# EAGLE design Raspberry Pi PCB (EAGLE 9.0.1)

## Sheet 1 of 2
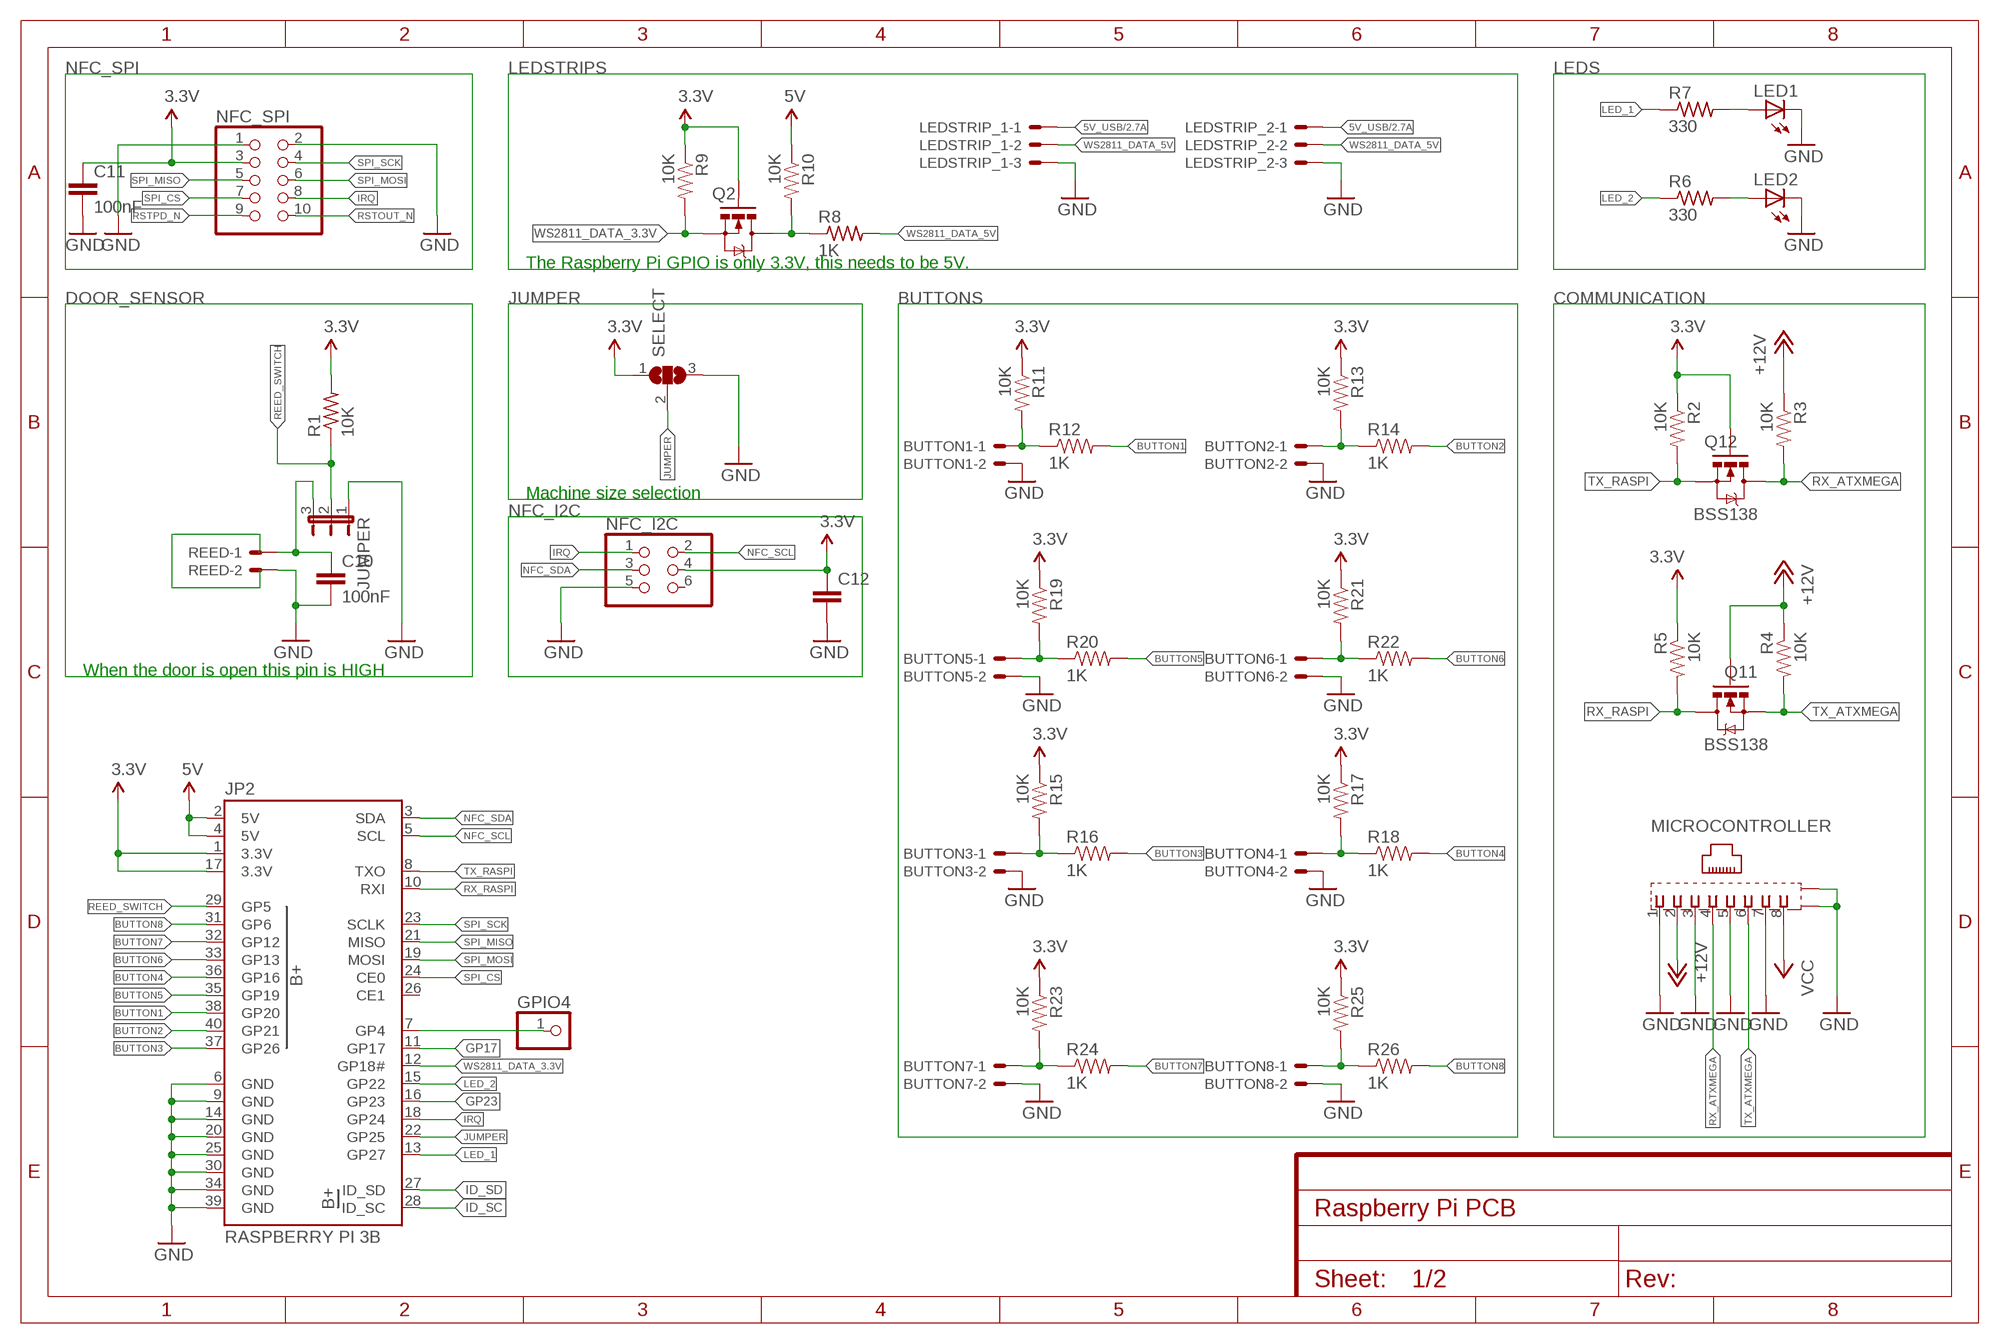
[diagram p0: schematic, sheet 1]
FRAME1 (FRAME-A4L): SPICEPREFIX: X

### Parts
BUTTON1  22-05-7028-02  [7395-02]
BUTTON2  22-05-7028-02  [7395-02]
BUTTON3  22-05-7028-02  [7395-02]
BUTTON4  22-05-7028-02  [7395-02]
BUTTON5  22-05-7028-02  [7395-02]
BUTTON6  22-05-7028-02  [7395-02]
BUTTON7  22-05-7028-02  [7395-02]
BUTTON8  22-05-7028-02  [7395-02]
C10  100nF  1.0UF-0805-25V-(+80/-20%)  [0805]
C11  100nF  1.0UF-0805-25V-(+80/-20%)  [0805]
C12  100nF  1.0UF-0805-25V-(+80/-20%)  [0805]
GPIO4  PINHD-1X1  [1X01]
JP2  RASPBERRY PI 3B  RASPBERRYPI-B+-GPIO  [2X20-SHROUDED]
JUMPER  JP2E  [JP2]
LED1  LEDCHIPLED_0805  [CHIPLED_0805]
LED2  LEDCHIPLED_0805  [CHIPLED_0805]
LEDSTRIP_1  22-05-7038-03  [7395-03]
LEDSTRIP_2  22-05-7038-03  [7395-03]
MICROCONTROLLER  0446200002  [0446200002]
NFC_I2C  PINHD-2X3  [2X03]
NFC_SPI  PINHD-2X5  [2X05]
Q2  BSS138  MOSFET-NCHANNELSMD  [SOT23-3]
Q11  BSS138  MOSFET-NCHANNELSMD  [SOT23-3]
Q12  BSS138  MOSFET-NCHANNELSMD  [SOT23-3]
R1  10K  R-US_R0805  [R0805]
R2  10K  RESISTOR0603-RES  [0603-RES]
R3  10K  RESISTOR0603-RES  [0603-RES]
R4  10K  RESISTOR0603-RES  [0603-RES]
R5  10K  RESISTOR0603-RES  [0603-RES]
R6  330  R-US_R0805  [R0805]
R7  330  R-US_R0805  [R0805]
R8  1K  R-US_R0805  [R0805]
R9  10K  RESISTOR0603-RES  [0603-RES]
R10  10K  RESISTOR0603-RES  [0603-RES]
R11  10K  RESISTOR0603-RES  [0603-RES]
R12  1K  RESISTOR0603-RES  [0603-RES]
R13  10K  RESISTOR0603-RES  [0603-RES]
R14  1K  RESISTOR0603-RES  [0603-RES]
R15  10K  RESISTOR0603-RES  [0603-RES]
R16  1K  RESISTOR0603-RES  [0603-RES]
R17  10K  RESISTOR0603-RES  [0603-RES]
R18  1K  RESISTOR0603-RES  [0603-RES]
R19  10K  RESISTOR0603-RES  [0603-RES]
R20  1K  RESISTOR0603-RES  [0603-RES]
R21  10K  RESISTOR0603-RES  [0603-RES]
R22  1K  RESISTOR0603-RES  [0603-RES]
R23  10K  RESISTOR0603-RES  [0603-RES]
R24  1K  RESISTOR0603-RES  [0603-RES]
R25  10K  RESISTOR0603-RES  [0603-RES]
R26  1K  RESISTOR0603-RES  [0603-RES]
REED  22-05-7028-02  [7395-02]
SELECT  SJ2W  [SJ_2]

### Nets
3.3V: C11.1 C12.1 JP2.1(3.3V) JP2.17(3.3V) NFC_I2C.4 NFC_SPI.3 Q2.1(G) Q12.1(G) R1.2 R2.1 R5.1 R9.1 R11.1 R13.1 R15.1 R17.1 R19.1 R21.1 R23.1 R25.1 SELECT.1
5V: JP2.2(5V) JP2.4(5V) R10.1 ; also sheet 2
5V_USB: LEDSTRIP_1.1 LEDSTRIP_2.1 ; also sheet 2
+12V: MICROCONTROLLER.2 Q11.1(G) R3.1 R4.1
BUTTON1: JP2.38(GP20) R12.2
BUTTON2: JP2.40(GP21) R14.2
BUTTON3: JP2.37(GP26) R16.2
BUTTON4: JP2.36(GP16) R18.2
BUTTON5: JP2.35(GP19) R20.2
BUTTON6: JP2.33(GP13) R22.2
BUTTON7: JP2.32(GP12) R24.2
BUTTON8: JP2.31(GP6) R26.2
GND: BUTTON1.2 BUTTON2.2 BUTTON3.2 BUTTON4.2 BUTTON5.2 BUTTON6.2 BUTTON7.2 BUTTON8.2 C10.2 C11.2 C12.2 JP2.6(GND) JP2.9(GND) JP2.14(GND) JP2.20(GND) JP2.25(GND) JP2.30(GND) JP2.34(GND) JP2.39(GND) JUMPER.1 LED1.C LED2.C LEDSTRIP_1.3 LEDSTRIP_2.3 MICROCONTROLLER.1 MICROCONTROLLER.3 MICROCONTROLLER.5 MICROCONTROLLER.7 MICROCONTROLLER.S@1(S1) MICROCONTROLLER.S@2(S2) NFC_I2C.5 NFC_SPI.1 NFC_SPI.2 REED.2 SELECT.3 ; also sheet 2
GP4: GPIO4.1 JP2.7(GP4)
GP17: JP2.11(GP17)
GP23: JP2.16(GP23)
ID_SC: JP2.28(ID_SC)
ID_SD: JP2.27(ID_SD)
IRQ: JP2.18(GP24) NFC_I2C.1 NFC_SPI.8
JUMPER: JP2.22(GP25) SELECT.2
LED_1: JP2.13(GP27) R7.1
LED_2: JP2.15(GP22) R6.1
N$1: C10.1 JUMPER.3 REED.1
N$2: BUTTON2.1 R13.2 R14.1
N$3: Q2.3(D) R8.1 R10.2
N$4: LED2.A R6.2
N$5: LED1.A R7.2
N$6: BUTTON1.1 R11.2 R12.1
N$7: BUTTON3.1 R15.2 R16.1
N$8: BUTTON4.1 R17.2 R18.1
N$9: BUTTON5.1 R19.2 R20.1
N$10: BUTTON6.1 R21.2 R22.1
N$11: BUTTON7.1 R23.2 R24.1
N$12: BUTTON8.1 R25.2 R26.1
NFC_SCL: JP2.5(SCL) NFC_I2C.2
NFC_SDA: JP2.3(SDA) NFC_I2C.3
REED_SWITCH: JP2.29(GP5) JUMPER.2 R1.1
RSTOUT_N: NFC_SPI.10
RSTPD_N: NFC_SPI.9
RX_ATXMEGA: MICROCONTROLLER.4 Q12.3(D) R3.2
RX_RASPI: JP2.10(RXI) Q11.3(D) R5.2
SPI_CS: JP2.24(CE0) NFC_SPI.7
SPI_MISO: JP2.21(MISO) NFC_SPI.5
SPI_MOSI: JP2.19(MOSI) NFC_SPI.6
SPI_SCK: JP2.23(SCLK) NFC_SPI.4
TX_ATXMEGA: MICROCONTROLLER.6 Q11.2(S) R4.2
TX_RASPI: JP2.8(TXO) Q12.2(S) R2.2
VCC: MICROCONTROLLER.8
WS2811_DATA_3.3V: JP2.12(GP18#) Q2.2(S) R9.2
WS2811_DATA_5V: LEDSTRIP_1.2 LEDSTRIP_2.2 R8.2
Unconnected: JP2.26(CE1) NFC_I2C.6

### Notes on the sheet
- The Raspberry Pi GPIO is only 3.3V, this needs to be 5V.
- Machine size selection
- When the door is open this pin is HIGH

## Sheet 2 of 2
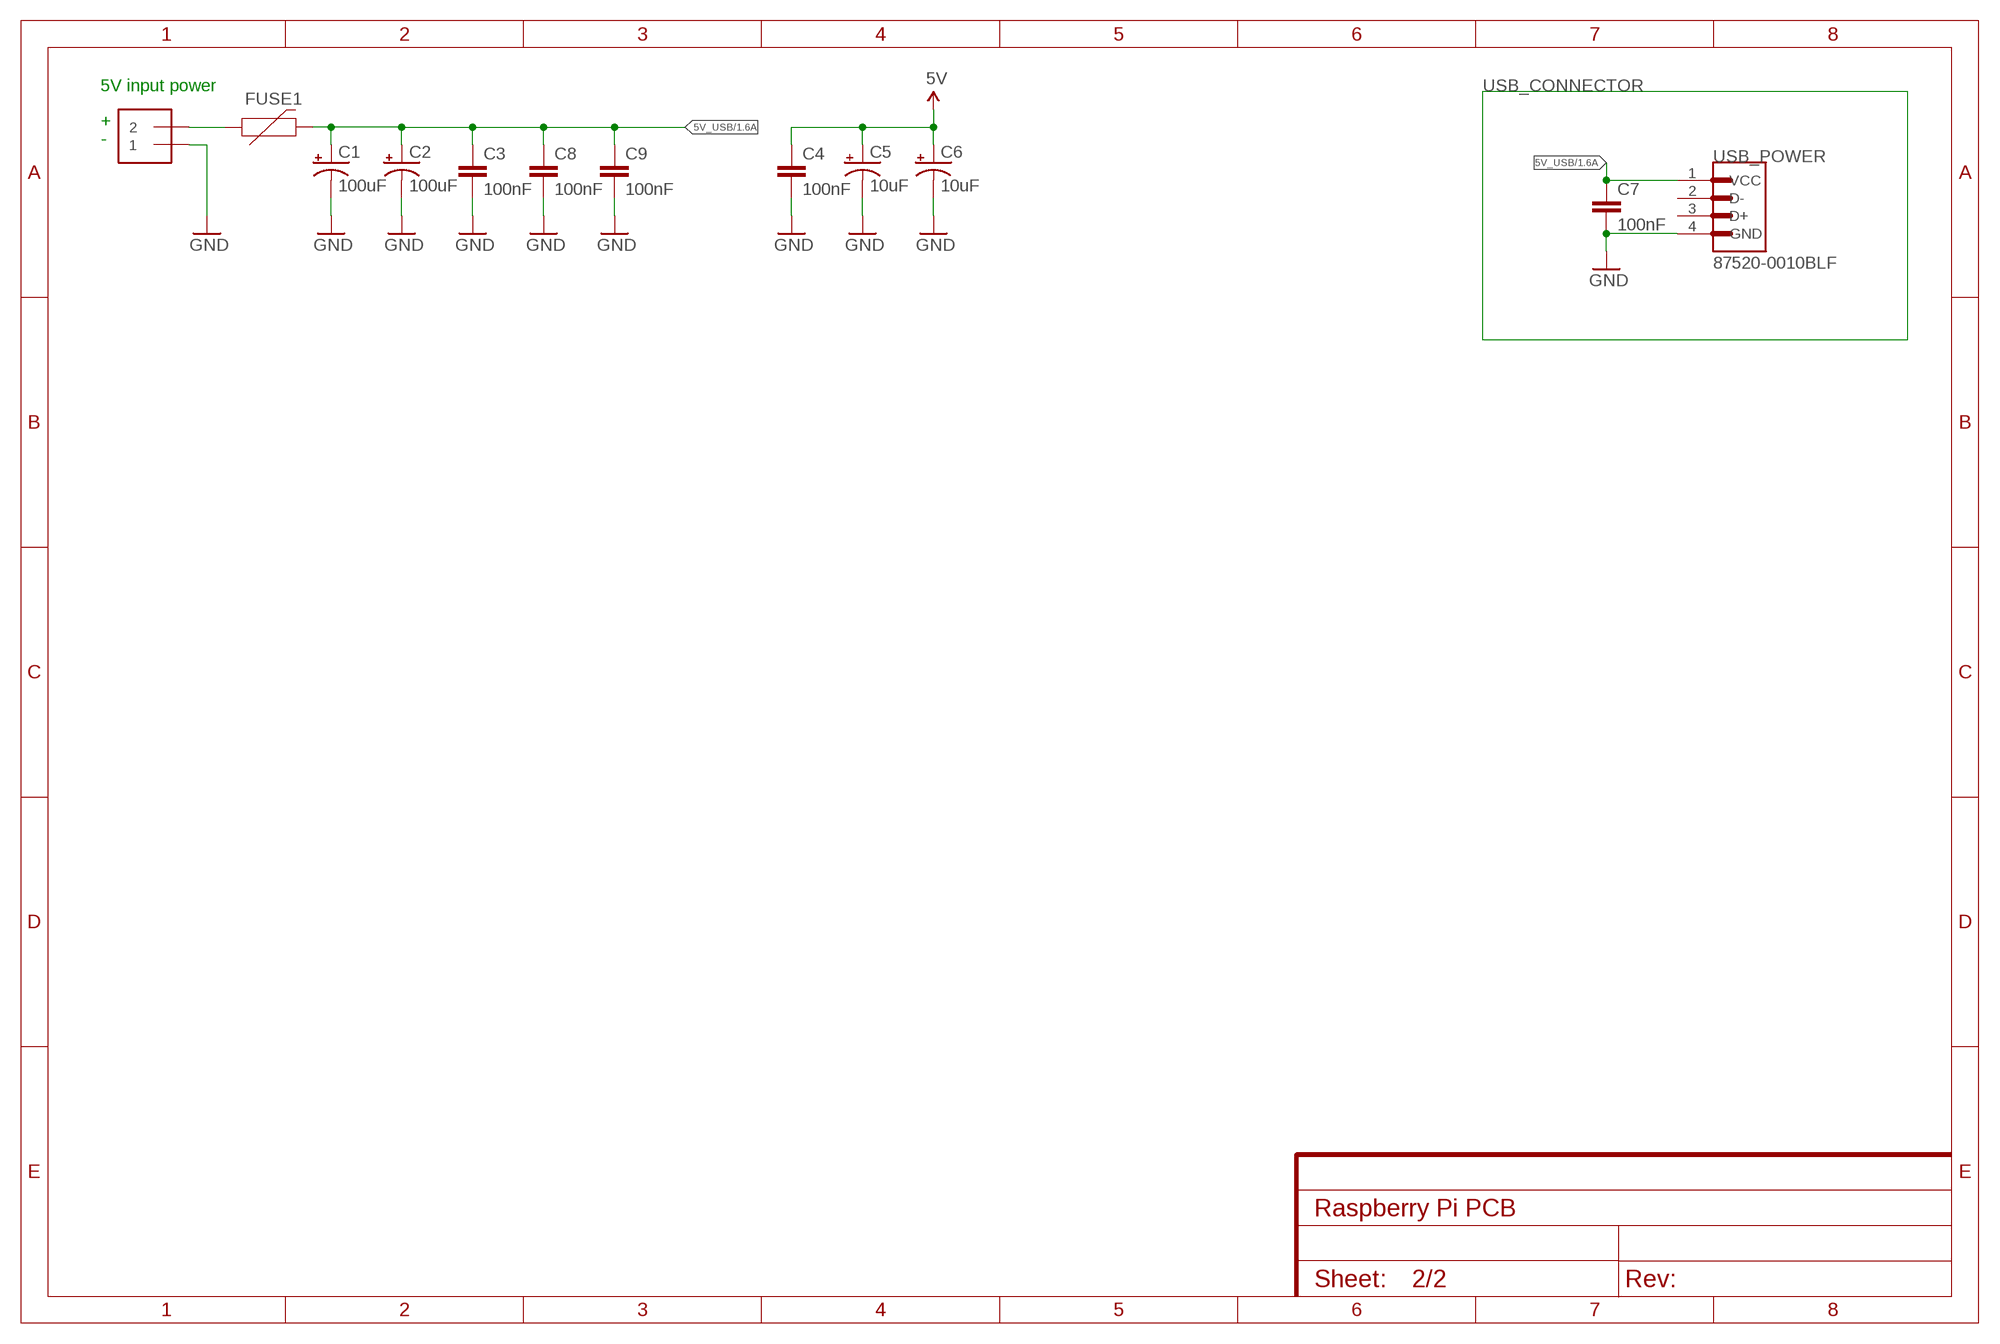
[diagram p1: schematic, sheet 2]

### Parts
C1  100uF  CPOL-US175TMP-0810  [175TMP-0810]
C2  100uF  CPOL-US175TMP-0810  [175TMP-0810]
C3  100nF  1.0UF-0805-25V-(+80/-20%)  [0805]
C4  100nF  1.0UF-0805-25V-(+80/-20%)  [0805]
C5  10uF  CPOL-US153CLV-0505  [153CLV-0505]
C6  10uF  CPOL-US153CLV-0505  [153CLV-0505]
C7  100nF  1.0UF-0805-25V-(+80/-20%)  [0805]
C8  100nF  1.0UF-0805-25V-(+80/-20%)  [0805]
C9  100nF  1.0UF-0805-25V-(+80/-20%)  [0805]
FUSE1  6V/0.5A  PPTC_HALF-AMP  [1206]
INPUT  1X2-3.5MM  [1X2-3.5MM]
USB_POWER  87520-0010BLF  [FCI_87520-0010BLF]

### Nets
5V: C4.1 C5.+ C6.+ ; also sheet 1
5V_USB: C1.+ C2.+ C3.1 C7.1 C8.1 C9.1 FUSE1.2 USB_POWER.1(VCC) ; also sheet 1
GND: C1.- C2.- C3.2 C4.2 C5.- C6.- C7.2 C8.2 C9.2 INPUT.1 USB_POWER.4(GND) ; also sheet 1
VIN1: FUSE1.1 INPUT.2
Unconnected: USB_POWER.2(D-) USB_POWER.3(D+)

### Notes on the sheet
- 5V input power
- +
- -

## Library data of the parts
BUTTON1-BUTTON8 REED = con-molex:22-?-02: CONNECTOR wire to board 2.54 mm (.1 inch) pitch header; MF: MOLEX; OC_FARNELL: 9731601; OC_NEWARK: unknown
C1 C2 C5 C6 = adafruit:CPOL-US: POLARIZED CAPACITOR, American symbol
C3 C4 C7-C12 = SparkFun-Capacitors:1.0UF: 1µF ceramic capacitors A capacitor is a passive two-terminal electrical component used to store electrical energy temporarily in an electric field.; PROD_ID: CAP-11625; VALUE: 1.0uF
FUSE1 = SparkFun-Fuses:PPTC: Resettable Fuse PPTC Resettable Fuse. Really a sort of resistor with a polymeric positive temperature coefficient whose resistance increases dramatically with an increase in temperature. When heated by the power passing through the resistance rises causing the current to be limited, protecting the circuit. This is achieved by the transition of the polymer from a crystalline to an amorphous state where the conductive carbon separates breaking the conductive pathways found in the cool crystalline structure. When a PPTC cools back down it resumes conducting letting the circuit turn back on. SparkFun Products: SparkFun RedBoard - Programmed with Arduino <https://www.sparkfun.com/products/12757> Pro Micro - 5V/16MHz <https://www.sparkfun.com/products/12640> Arduino Pro 328 - 5V/16MHz <https://www.sparkfun.com/products/10915> MP3 Trigger <https://www.sparkfun.com/products/13720>; PROD_ID: RES-08585
GPIO4 = pinhead:PINHD-1X1: PIN HEADER
INPUT = adafruit:1X2: 3.5mm Terminal block http://www.ladyada.net/library/pcb/eaglelibrary.html
JP2 = SparkFun-Boards:RASPBERRYPI-B+-GPIO: Raspberry Pi B+ GPIO Header 2x20 pin connector
JUMPER = jumper:JP2E: JUMPER
LED1 LED2 = adafruit:LED: LED OSRAM: - CHIPLED LG R971, LG N971, LY N971, LG Q971, LY Q971, LO R971, LY R971 LH N974, LH R974 LS Q976, LO Q976, LY Q976 LO Q996 - Hyper CHIPLED LW Q18S LB Q993, LB Q99A, LB R99A - SideLED LS A670, LO A670, LY A670, LG A670, LP A670 LB A673, LV A673, LT A673, LW A673 LH A674 LY A675 LS A676, LA A676, LO A676, LY A676, LW A676 LS A679, LY A679, LG A679 - Hyper Micro SIDELED® LS Y876, LA Y876, LO Y876, LY Y876 LT Y87S - SmartLED LW L88C, LW L88S LB L89C, LB L89S, LG L890 LS L89K, LO L89K, LY L89K LS L896, LA L896, LO L896, LY L896 - TOPLED LS T670, LO T670, LY T670, LG T670, LP T670 LSG T670, LSP T670, LSY T670, LOP T670, LYG T670 LG T671, LOG T671, LSG T671 LB T673, LV T673, LT T673, LW T673 LH T674 LS T676, LA T676, LO T676, LY T676, LB T676, LH T676, LSB T676, LW T676 LB T67C, LV T67C, LT T67C, LS T67K, LO T67K, LY T67K, LW E67C LS E67B, LA E67B, LO E67B, LY E67B, LB E67C, LV E67C, LT E67C LW T67C LS T679, LY T679, LG T679 LS T770, LO T770, LY T770, LG T770, LP T770 LB T773, LV T773, LT T773, LW T773 LH T774 LS E675, LA E675, LY E675, LS T675 LS T776, LA T776, LO T776, LY T776, LB T776 LHGB T686 LT T68C, LB T68C - Hyper Mini TOPLED® LB M676 - Mini TOPLED Santana® LG M470 LS M47K, LO M47K, LY M47K Source: http://www.osram.convergy.de/
LEDSTRIP_1 LEDSTRIP_2 = con-molex:22-?-03: CONNECTOR wire to board 2.54 mm (.1 inch) pitch header; MF: MOLEX; OC_FARNELL: unknown; OC_NEWARK: unknown
MICROCONTROLLER = con-molex:0446200002: RJ-45 INVERTED MODULAR JACK ASSEMBLY WITH RJ-11 KEEPOUT FEATURE Source: Data sheet <http://www.farnell.com/datasheets/73207.pdf> MOLEX 0446200002 BUCHSE, RJ45, GESCHIRMT Source: Farnell <http://de.farnell.com/molex/0446200002/buchse-rj45-geschirmt/dp/9251910?ost=9251910>; MF: MOLEX; MPN: 0446200002; OC_FARNELL: 9251910
NFC_I2C = pinhead:PINHD-2X3: PIN HEADER
NFC_SPI = pinhead:PINHD-2X5: PIN HEADER
Q2 Q11 Q12 = SparkFun:MOSFET-NCHANNEL
R1 R6-R8 = adafruit:R-US_: RESISTOR, American symbol
R2-R5 R9-R26 = SparkFun:RESISTOR: Resistor Basic schematic elements and footprints for 0603, 1206, and PTH resistors.
SELECT = jumper:SJ2W: SMD solder JUMPER
USB_POWER = 87520-0010BLF:87520-0010BLF: USB - A USB 2.0 Receptacle Connector 4 Position Through Hole, Right Angle; DESCRIPTION: 87520 Series Single Port 4 Contact Unshielded Board Lock USB-A Receptacle; DIGI-KEY_PART_NUMBER: 609-1045-ND; DIGI-KEY_PURCHASE_URL: https://www.digikey.nl/product-detail/en/amphenol-fci/87520-0010BLF/609-1045-ND/1001359?WT.z_cid=ref_snapeda&utm_source=snapeda&utm_medium=aggregator&utm_campaign=buynow; MF: Amphenol ICC; MP: 87520-0010BLF; PACKAGE: None

## Board
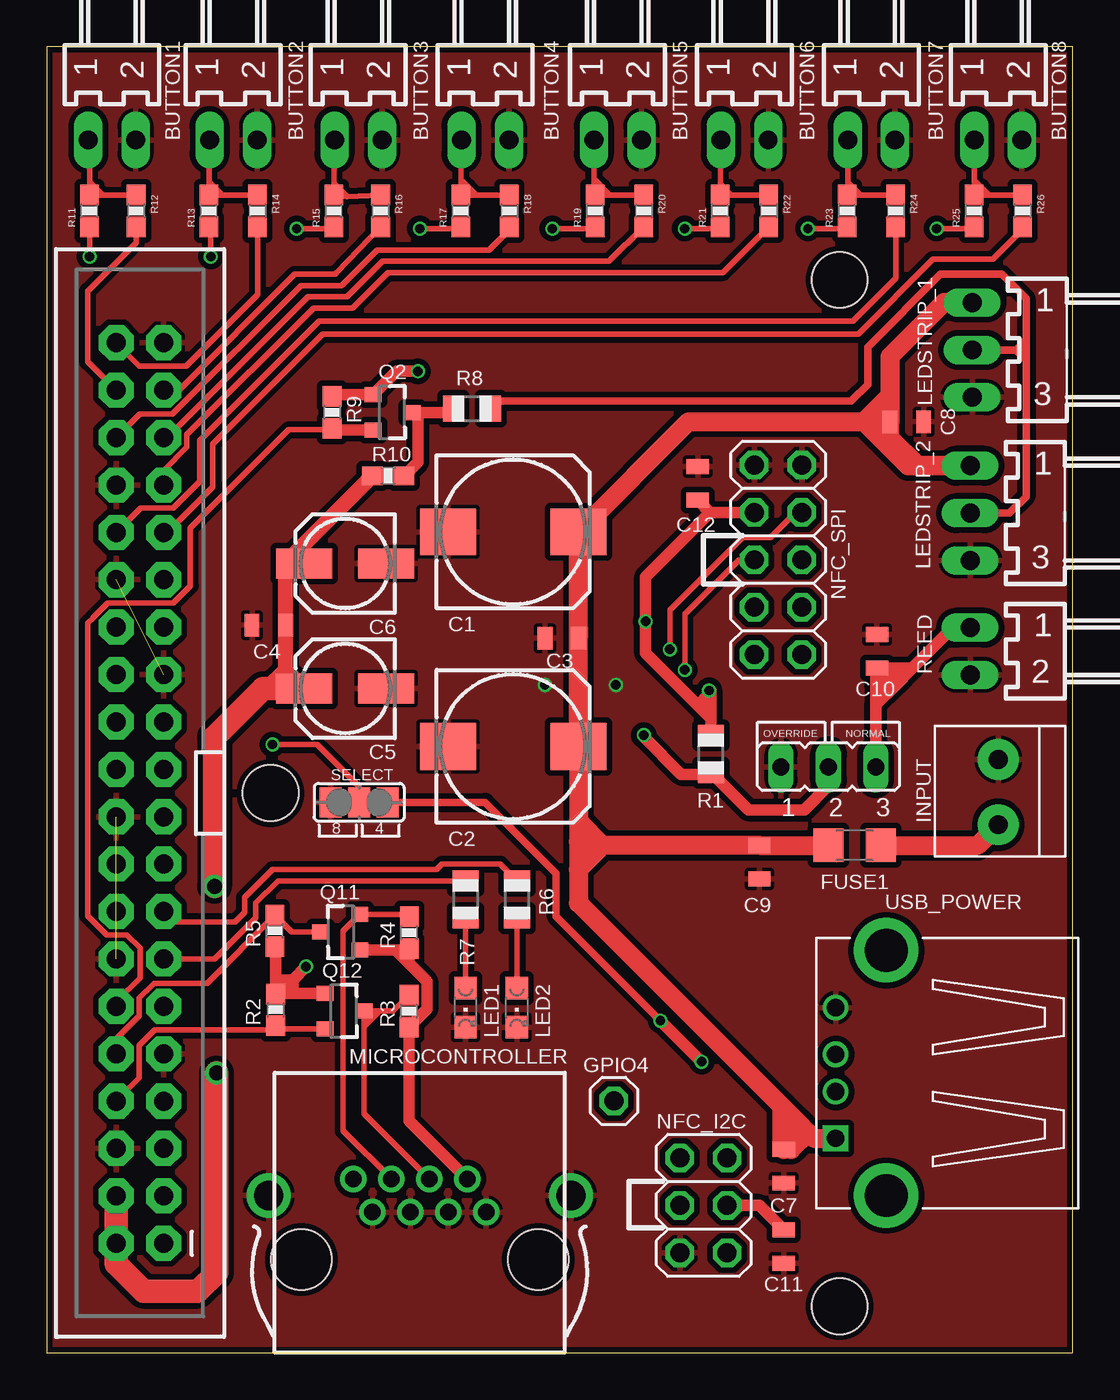
[diagram p2: board, top side]
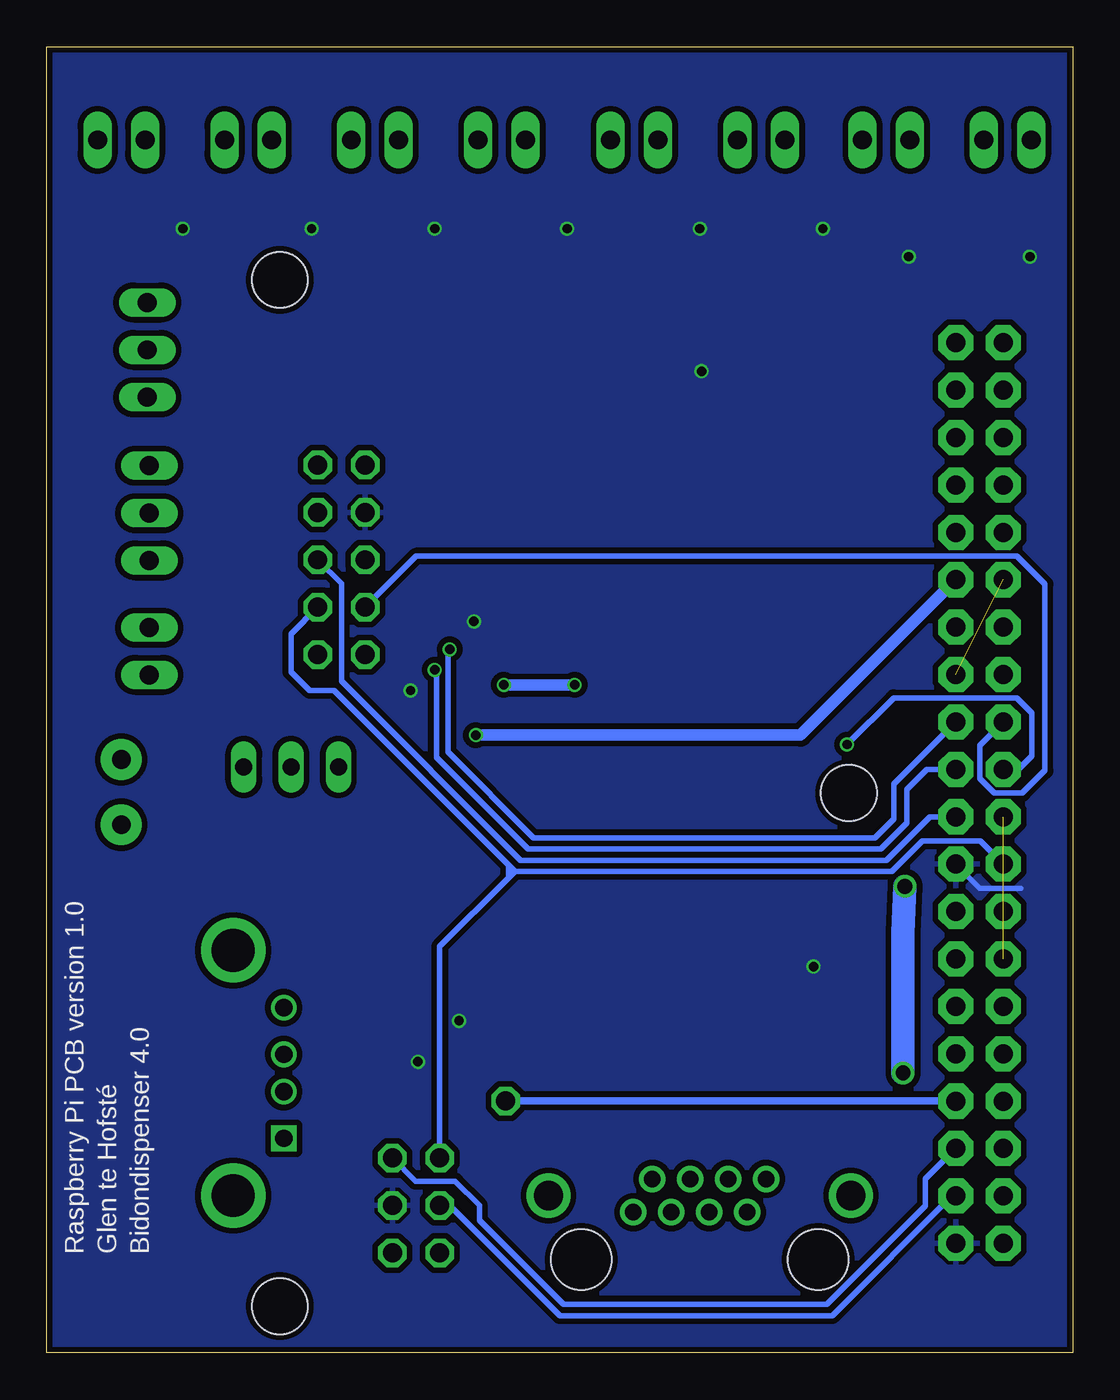
[diagram p3: board, bottom side, seen from below]

Size 55 x 70 mm. Coordinates in mm from the lower left corner, seen from the top.
Outline: 55,70 0,70 0,0 55,0 55,70
Copper layers (1*16): Top 0.018mm / dielectric 1.55mm / Bottom 0.018mm
Design rules "eC_2Layer_PClass6_BaseCopperO18_eCDefault": minimum track width 0.15mm, minimum drill 0.35mm, track to track 0.15mm, track to pad 0.15mm, pad to pad 0.15mm, via to via 0.15mm, smd to smd 0mil, copper to edge 0.25mm, drill to drill 0.35mm, minimum pad ring 0.175mm, minimum via ring 0.125mm, stop-mask expansion 0mil, vias tented up to drill 0.45mm, thermal gap 0.2mm
Holes 3 mm at 42.5,57.5 42.5,2.5 12,30

### Footprints (pad centres in the part's own frame; a part is rotated, then mirrored left to right if it is on the bottom)
7395-02 = drill 1.016 long: 1 1.27,0; 2 -1.27,0
175TMP-0810 = smd 3 x 2.5: + 3.5,0; - -3.5,0
0805 = smd 0.8 x 1.2: 1 -0.9,0; 2 0.9,0
153CLV-0505 = smd 3 x 1.6: + 2.2,0; - -2.2,0
1206 = smd 1.6 x 1.8: 1 -1.4,0; 2 1.4,0
1X01 = drill 1.016 octagon: 1 0,0
1X2-3.5MM = drill 1 pad 2.184: 1 1.8,0; 2 -1.7,0
2X20-SHROUDED = drill 1.016 pad 1.88 octagon: 1 -1.27,24.13; 2 1.27,24.13; 3 -1.27,21.59; 4 1.27,21.59; 5 -1.27,19.05; 6 1.27,19.05; 7 -1.27,16.51; 8 1.27,16.51; 9 -1.27,13.97; 10 1.27,13.97; 11 -1.27,11.43; 12 1.27,11.43; 13 -1.27,8.89; 14 1.27,8.89; 15 -1.27,6.35; 16 1.27,6.35; 17 -1.27,3.81; 18 1.27,3.81; 19 -1.27,1.27; 20 1.27,1.27; 21 -1.27,-1.27; 22 1.27,-1.27; 23 -1.27,-3.81; 24 1.27,-3.81; 25 -1.27,-6.35; 26 1.27,-6.35; 27 -1.27,-8.89; 28 1.27,-8.89; 29 -1.27,-11.43; 30 1.27,-11.43; 31 -1.27,-13.97; 32 1.27,-13.97; 33 -1.27,-16.51; 34 1.27,-16.51; 35 -1.27,-19.05; 36 1.27,-19.05; 37 -1.27,-21.59; 38 1.27,-21.59; 39 -1.27,-24.13; 40 1.27,-24.13
JP2 = drill 0.914 long: 1 -2.54,0; 2 0,0; 3 2.54,0
CHIPLED_0805 = smd 1.2 x 1.2: A 0,-1.05; C 0,1.05
7395-03 = drill 1.016 long: 1 2.54,0; 2 0,0; 3 -2.54,0
0446200002 = drill 0.889 pad 1.422: 1 3.556,2.54; 2 2.54,4.318; 3 1.524,2.54; 4 0.508,4.318; 5 -0.508,2.54; 6 -1.524,4.318; 7 -2.54,2.54; 8 -3.556,4.318 | drill 1.575 pad 2.286: S@1 -8.103,3.429; S@2 8.103,3.429 | hole 3.251: 6.35,0; -6.35,0
2X03 = drill 1.016 octagon: 1 -2.54,-1.27; 2 -2.54,1.27; 3 0,-1.27; 4 0,1.27; 5 2.54,-1.27; 6 2.54,1.27
2X05 = drill 1.016 octagon: 1 -5.08,-1.27; 2 -5.08,1.27; 3 -2.54,-1.27; 4 -2.54,1.27; 5 0,-1.27; 6 0,1.27; 7 2.54,-1.27; 8 2.54,1.27; 9 5.08,-1.27; 10 5.08,1.27
SOT23-3 = smd 0.8 x 0.9: 1 -0.95,-1; 2 0.95,-1; 3 0,1.1
R0805 = smd 1.1 x 1.4: 1 -1,0; 2 1,0
0603-RES = smd 1.1 x 1: 1 -0.85,0; 2 0.85,0
SJ_2 = smd 1.168 x 1.6: 1 -1.524,0; 2 0,0; 3 1.524,0
FCI_87520-0010BLF = drill 0.92 square: 1 -3.5,2.71 | drill 0.92: 2 -1,2.71; 3 1,2.71; 4 3.5,2.71 | drill 2.3: P1 -6.57,0; P2 6.57,0

### Placement (x,y rotation side)
BUTTON1  3.5,65 180 top
BUTTON2  10,65 180 top
BUTTON3  16.7,65 180 top
BUTTON4  23.5,65 180 top
BUTTON5  30.6,65 180 top
BUTTON6  37.4,65 180 top
BUTTON7  44.2,65 180 top
BUTTON8  51,65 180 top
C1  25,44 0 top
C2  25,32.5 0 top
C3  27.6,38.3 180 top
C4  11.9,39 180 top
C5  16,35.6 180 top
C6  16,42.3 180 top
C7  39.5,10 270 top
C8  46.1,49.9 0 top
C9  38.2,26.3 270 top
C10  44.5,37.6 90 top
C11  39.5,5.7 270 top
C12  34.9,46.6 90 top
FUSE1  43.3,27.2 180 top
GPIO4  30.4,13.5 0 top
INPUT  51,30 90 top
JP2  5,30 180 top
JUMPER  41.9,31.4 0 top
LED1  22.45,18.5 180 top
LED2  25.2,18.5 180 top
LEDSTRIP_1  49.6,53.75 90 top
LEDSTRIP_2  49.5,45 90 top
MICROCONTROLLER  20,5 0 top
NFC_I2C  35.2,7.9 270 top
NFC_SPI  39.2,42.5 270 top
Q2  18.5,50.4 270 top
Q11  15.78,22.55 90 top
Q12  15.92,18.32 270 top
R1  35.6,32.1 90 top
R2  12.27,18.39 270 top
R3  19.43,18.31 90 top
R4  19.43,22.51 90 top
R5  12.23,22.61 90 top
R6  25.2,24.3 270 top
R7  22.45,24.3 270 top
R8  22.8,50.6 0 top
R9  15.3,50.4 270 top
R10  18.3,47 0 top
R11  2.3,61.2 90 top
R12  4.8,61.2 270 top
R13  8.7,61.2 90 top
R14  11.3,61.2 270 top
R15  15.4,61.2 90 top
R16  17.9,61.2 270 top
R17  22.2,61.2 90 top
R18  24.8,61.2 270 top
R19  29.4,61.2 90 top
R20  32,61.2 270 top
R21  36.1,61.2 90 top
R22  38.7,61.2 270 top
R23  42.9,61.2 90 top
R24  45.5,61.2 270 top
R25  49.7,61.2 90 top
R26  52.3,61.2 270 top
REED  49.5,37.6 90 top
SELECT  16.75,29.5 180 top
USB_POWER  45,15 90 top

### Tracks (layer width: path | path; a pad name or v marks a point on that pad's centre or on a via)
3.3V  (via drill 0.5)
  Top 0.305: v2.3,58.75 R11.1 | v8.8,58.75 8.8,60.25 R13.1 | v13.4,60.25 15.3,60.25 R15.1 | v20,60.25 22.1,60.25 R17.1 | v27.1,60.25 29.3,60.25 R19.1 | v34.2,60.25 36,60.25 R21.1 | v40.8,60.25 42.8,60.25 R23.1 | v47.7,60.25 49.6,60.25 R25.1
  Top 0.406: SELECT.1 23.5,29.5 27.3,25.7 27.3,23.4 v32.9,17.8
  Top 0.61: R5.1 12.27,21.72 12.27,20.2 | 12.27,20.2 R2.1 | R2.1 12.31,19.27 13.2,19.27 | 13.2,19.27 Q12.1 | 13.2,19.27 12.47,20 | v13.9,20.7 13.2,20 | 13.2,20 12.44,19.24 R2.1 | 13.2,20 13.2,19.27 | 13.2,20 12.47,20 | 12.47,20 12.27,20.2 | R9.1 15.4,51.35 Q2.1 18.75,52.6 v19.9,52.6 | 35.6,34 35.6,35.5 v35.5,35.5 35.5,35.3 34.9,34.7 | 35.6,34 R1.2 | C12.1 35.56,45.04 | 35.56,45.04 NFC_SPI.3 | 35.6,34 34.9,34.7 | 34.9,34.7 32.1,37.5 v32.1,39.2 32.1,41.58 35.56,45.04 | C11.1 38.2,7.9 NFC_I2C.4 | v35.1,15.6 v32.9,17.8
  Bottom 0.305: JP2.17 4.98,24.9 2.8,24.9
  pour Bottom (isolate 0.305, rank 2): 0,70 55,70 55,0 0,0
5V  (via drill 0.8)
  Top 0.813: C5.+ 12.8,36.6 | 12.8,36.6 C4.1 12.8,42 | 12.8,42 13.1,42.3 C6.+ 13.8,43.35 | 12.8,36.6 11.8,35.6 11.6,35.6 | 13.8,43.35 R10.1 | 13.8,43.35 12.8,42.35 12.8,42
  Top 1.27: JP2.4 JP2.2 3.73,4.77 5.2,3.3 8.1,3.3 9.1,4.3 v9.1,15 | C5.+ 11.6,35.6 9,33 v9,25
  Bottom 1.27: v9,25 9.1,22.5 v9.1,15
5V_USB
  Top 1.016: C3.1 C2.+ 28.5,28.5 | C3.1 C1.+ | 28.5,44.6 C1.+ | 28.5,38.9 C3.1 | 28.5,28.5 28.5,27.4 | 28.5,27.4 28.5,25.9 | 28.5,25.9 28.5,24.1 39.4,13.2 | USB_POWER.1 41.1,11.5 40.8,11.8 | 39.4,13.2 40.15,12.45 | 40.15,12.45 40.8,11.8 | 40.8,11.8 39.9,10.9 C7.1 39.4,11 39.4,11.4 | 39.4,11.4 39.4,13.2 | 40.15,12.45 40.15,12.15 39.4,11.4 | 29.8,27.2 28.7,27.2 28.5,27.4 | 29.8,27.2 28.5,28.5 | 29.8,27.2 28.5,25.9 | 29.8,27.2 C9.1 FUSE1.2 | C1.+ 34.4,49.9 43.8,49.9 | 43.8,49.9 C8.1 | C8.1 45.2,49 46.66,47.54 LEDSTRIP_2.1 46.16,47.54 43.8,49.9 | 50.41,56.29 LEDSTRIP_1.1 48.09,56.29 45.2,53.4 45.2,51.3 | 45.2,51.3 C8.1 | 45.2,51.3 43.8,49.9
+12V
  Top 0.305: Q11.1 16.9,21.61 | R3.1 19.43,16.7
  Top 0.61: 19.43,20.88 19.43,21.55 19.37,21.61 | R4.1 19.37,21.61 | 19.37,21.61 18.7,21.61 | 18.7,21.61 16.9,21.61 | 18.7,21.61 19.43,20.88 | MICROCONTROLLER.2 19.43,12.43 19.43,16.7 R3.1 20.38,18.43 20.38,19.9 19.43,20.86 19.43,20.88
BUTTON1
  Top 0.305: JP2.38 2.2,53.12 2.2,56.9 4.8,59.5 R12.2
BUTTON2
  Top 0.305: JP2.40 4.97,52.89 7.49,52.89 11.3,56.7 R14.2
BUTTON3
  Top 0.305: R16.2 15.55,57.9 15.45,57.8 13.3,57.8 7.09,51.59 JP2.37
BUTTON4
  Top 0.305: R18.2 24.8,60.2 23.7,59.1 17.7,59.1 15.8,57.2 13.64,57.2 6.74,50.3 4.98,50.3 JP2.36
BUTTON5
  Top 0.305: JP2.35 6.45,49.05 14,56.6 16.1,56.6 18,58.5 30.15,58.5 R20.2
BUTTON6
  Top 0.305: JP2.33 6.27,47.29 7.51,48.53 7.51,49.21 14.3,56 16.4,56 18.3,57.9 36.25,57.9 R22.2
BUTTON7
  Top 0.305: JP2.32 5.03,45.27 6.79,45.27 8.2,46.68 8.2,48.9 14.6,55.3 43.2,55.3 45.5,57.6 R24.2
BUTTON8
  Top 0.305: JP2.31 6.47,43.97 8.9,46.4 8.9,48.7 14.8,54.6 43.5,54.6 47.5,58.6 50.7,58.6 52.3,60.2 R26.2
GND  (via drill 0.5)  (2 unrouted)
  Bottom 0.61: v30.5,35.8 v26.7,35.8
  pour Top (isolate 0.305, rank 2): -0.1,70 55,70 55,0 -0.1,0
GP4
  Bottom 0.406: JP2.7 GPIO4.1
IRQ
  Bottom 0.305: JP2.18 4.97,27.43 8.07,27.43 9.7,25.8 29.9,25.8 | NFC_SPI.8 41.9,38.53 41.9,36.5 40.9,35.5 39.6,35.5 30.25,26.15 | 29.9,25.8 30.25,26.15 | 29.9,25.8 30.25,25.45 | NFC_I2C.1 33.93,21.77 30.3,25.4 30.25,25.45 | 30.25,26.15 30.25,25.45
JUMPER  (via drill 0.5)
  Top 0.305: v12.1,32.6 14.5,32.6 16.75,30.35 SELECT.2
  Bottom 0.305: v12.1,32.6 9.6,35.1 3,35.1 2.2,34.3 2.2,32 2.93,31.27 JP2.22
LED_1
  Top 0.305: R7.1 12.4,25.3 11.2,24.1 11.2,23.3 9.01,21.11 JP2.13
LED_2
  Top 0.305: JP2.15 6.82,23.1 10.1,23.1 10.6,23.6 10.6,24.4 12.1,25.9 20.9,25.9 21.2,26.2 24.3,26.2 R6.1
N$1
  Top 0.61: JUMPER.3 44.44,34.74 | REED.1 48.57,38.87 46.4,36.7 | 44.44,34.74 45.5,35.8 | 45.5,35.8 46.4,36.7 | 44.44,35.8 44.44,36.64 C10.1 45.5,36.7 | 44.44,35.8 44.44,34.74 | 44.6,35.8 45.5,35.8 | 45.5,36.7 46.4,36.7 | 45.5,36.7 44.6,35.8 | 44.6,35.8 44.44,35.8 | 45.5,36.7 45.5,35.8
N$2
  Top 0.305: R14.1 9.4,62.05 | 9.4,62.05 R13.2 8.7,62.75 | BUTTON2.1 8.7,64.97 8.7,62.9 8.7,62.75 | 9.4,62.05 8.7,62.75
N$3
  Top 0.61: Q2.3 19.9,50.4 | 19.9,50.4 21.6,50.4 R8.1 | R10.2 19.9,47.75 19.9,50.4
N$4
  Top 0.305: R6.2 LED2.A
N$5
  Top 0.305: R7.2 LED1.A
N$6
  Top 0.305: 2.3,62.75 R11.2 3,62.05 | BUTTON1.1 2.3,64.93 2.3,62.9 2.3,62.75 | 3,62.05 R12.1 | 3,62.05 2.3,62.75
N$7
  Top 0.305: R16.1 16.1,61.95 | 16.1,61.95 R15.2 15.4,62.65 | 15.4,62.65 15.4,64.97 BUTTON3.1 | 16.1,61.95 15.4,62.65
N$8
  Top 0.305: R18.1 23,62.05 | 23,62.05 R17.2 22.2,62.85 | BUTTON4.1 22.2,64.97 22.2,62.9 22.2,62.85 | 23,62.05 22.2,62.85
N$9
  Top 0.305: R20.1 30.2,62.05 | 30.2,62.05 R19.2 29.33,62.12 29.33,62.9 | 29.33,62.9 BUTTON5.1 | 30.2,62.05 29.35,62.9 29.33,62.9
N$10
  Top 0.305: R22.1 36.7,62.05 | 36.7,62.05 R21.2 36.1,62.65 | BUTTON6.1 36.1,64.97 36.1,62.9 36.1,62.65 | 36.7,62.05 36.1,62.65
N$11
  Top 0.305: R24.1 43.6,62.05 | 43.6,62.05 R23.2 42.93,62.08 42.93,62.72 | BUTTON7.1 42.93,62.8 42.93,62.72 | 43.6,62.05 42.93,62.72
N$12
  Top 0.305: R26.1 50.5,62.05 | 50.5,62.05 R25.2 49.73,62.08 49.73,62.82 | BUTTON8.1 49.73,62.9 49.73,62.82 | 50.5,62.05 49.73,62.82
NFC_SCL
  Bottom 0.305: JP2.5 7.9,9.32 7.9,7.88 13.18,2.6 27.3,2.6 31.8,7.1 31.8,7.9 33.1,9.2 35.23,9.2 NFC_I2C.2
NFC_SDA
  Bottom 0.305: JP2.3 6.49,8.41 12.9,2 27.5,2 33.4,7.9 NFC_I2C.3
REED_SWITCH  (via drill 0.5)
  Top 0.61: JUMPER.2 41.9,30.4 40.6,29.1 37.6,29.1 R1.1 35.5,31 34,31 32,33 v32,33.1
  Bottom 0.61: JP2.29 14.6,33.1 v32,33.1
RX_ATXMEGA
  Top 0.305: 17.02,17.8 Q12.3 17.54,18.32 | 17.02,17.8 17.02,17.5 | 17.02,17.5 17.02,12.81 MICROCONTROLLER.4 | R3.2 18.58,18.32 17.84,18.32 | 17.02,17.8 17.54,18.32 | 17.54,18.32 17.84,18.32 | 17.02,17.5 17.84,18.32
RX_RASPI
  Top 0.305: Q11.3 13.14,22.55 R5.2 12.23,23.43 8.61,19.81 5.75,19.81 4.97,19.03 4.97,18.05 3.73,16.81 JP2.10
SPI_CS
  Bottom 0.305: JP2.24 5,32.54 5,30.78 4.22,30 2.7,30 1.5,31.2 1.5,41.2 3,42.7 35.19,42.7 NFC_SPI.7
SPI_MISO  (via drill 0.5)
  Top 0.305: v34.2,36.6 34.2,39.6 37.1,42.5 NFC_SPI.5
  Bottom 0.305: JP2.21 7.83,31.27 8.9,30.2 8.9,28.4 10.3,27 29.2,27 34.1,31.9 34.1,36.5 v34.2,36.6
SPI_MOSI
  Bottom 0.305: JP2.19 7.67,28.73 10,26.4 29.6,26.4 39.2,36 39.2,41.23 NFC_SPI.6
SPI_SCK  (via drill 0.5)
  Top 0.305: v33.4,37.7 33.4,39.8 37.3,43.7 38.8,43.7 40.14,45.04 NFC_SPI.4
  Bottom 0.305: JP2.23 9.6,30.48 9.6,28.6 10.6,27.6 28.9,27.6 33.5,32.2 33.5,37.6 v33.4,37.7
TX_ATXMEGA
  Top 0.305: R4.2 19.29,23.5 Q11.2 15.9,22.62 15.9,11.89 MICROCONTROLLER.6
TX_RASPI
  Top 0.305: Q12.2 12.44,17.37 R2.2 12.04,17.3 5.78,17.3 4.97,16.49 4.97,14.73 JP2.8
VIN1
  Top 1.016: FUSE1.1 49.9,27.2 INPUT.2
WS2811_DATA_3.3V
  Top 0.305: 15.38,49.48 12.97,49.48 7.7,44.2 7.7,41.1 6.79,40.19 3.27,40.19 2.49,39.41 2.49,39.39 2.2,39.1 2.2,23.42 3.22,22.4 4.3,22.4 5,21.7 5,20.1 3.73,18.83 JP2.12
  Top 0.61: Q2.2 15.4,49.45 15.38,49.48 R9.2
WS2811_DATA_5V
  Top 0.406: R8.2 24.2,51 43.1,51 44,51.9 44,53.9 47.9,57.8 51.2,57.8 52.5,56.5 52.5,54.3 | 52.5,54.3 52.5,53.8 | 52.5,53.8 52.5,53.2 | LEDSTRIP_2.2 51.6,45 52.5,45.9 52.5,53 52.5,53.2 | 52.5,53.8 52.45,53.75 51.95,53.75 | 51.95,53.75 LEDSTRIP_1.2 | 52.5,54.3 51.95,53.75 | 51.95,53.75 52.5,53.2

### Text on the board
bPlace: Bidondispenser 4.0 | Glen te Hofsté | Raspberry Pi PCB version 1.0
tNames: OVERRIDE | NORMAL | 8 | 4